# EAGLE design esp8266breakout (EAGLE 8.3.2)
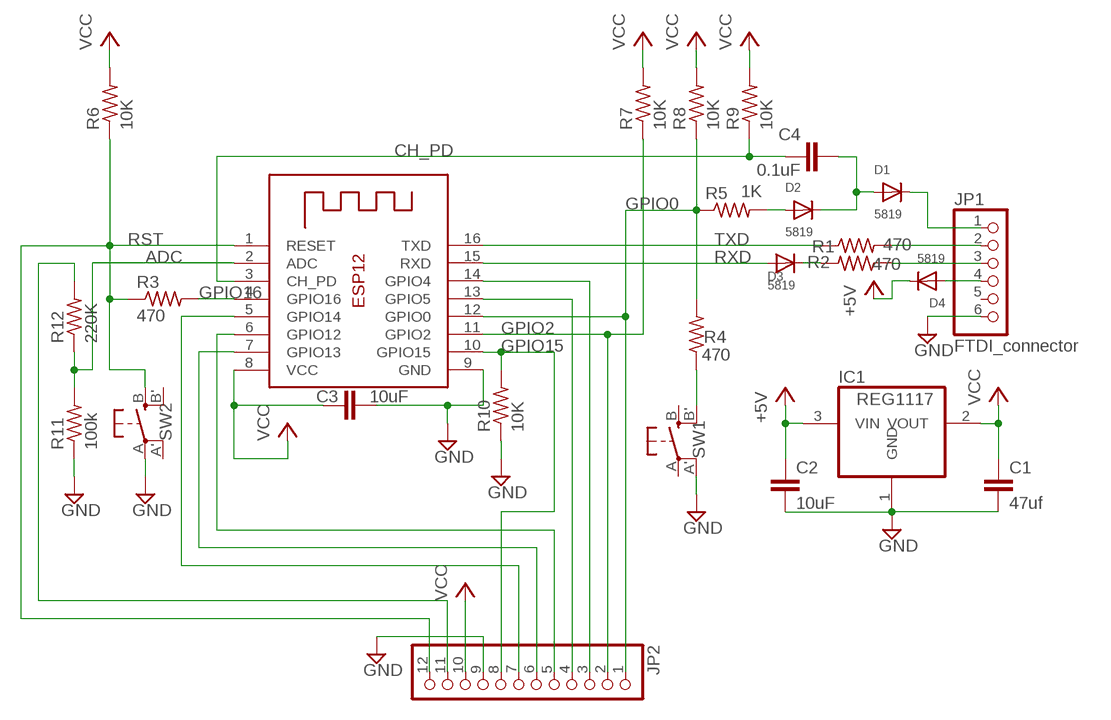
[diagram p0: schematic, sheet 1]

## Parts
C1  47uf  C-EUC1206K  [C1206K]
C2  10uF  C-EUC0805K  [C0805K]
C3  10uF  C-EUC0805K  [C0805K]
C4  0.1uF  C-EUC0805K  [C0805K]
D1  5819  DIODESOD-123  [SOD-123]
D2  5819  DIODESOD-123  [SOD-123]
D3  5819  DIODESOD-123  [SOD-123]
D4  5819  DIODESOD-123  [SOD-123]
IC1  REG1117  [SOT223]
JP1  FTDI_connector  PINHD-1X6LOCK  [1X06-BIGLOCK]
JP2  PINHD-1X12/90  [1X12/90]
R1  470  R-US_R0805  [R0805]
R2  470  R-US_R0805  [R0805]
R3  470  R-US_R0805  [R0805]
R4  470  R-US_R0805  [R0805]
R5  1K  R-US_R0805  [R0805]
R6  10K  R-US_R0805  [R0805]
R7  10K  R-US_R0805  [R0805]
R8  10K  R-US_R0805  [R0805]
R9  10K  R-US_R0805  [R0805]
R10  10K  R-US_R0805  [R0805]
R11  100k  R-US_R0805  [R0805]
R12  220K  R-US_R0805  [R0805]
SW1  6*6mm  SPST_TACT-EVQQ2  [EVQ-Q2]
SW2  6*6mm  SPST_TACT-EVQQ2  [EVQ-Q2]
X1  ESP_12S  ESP-12  [ESP-12]

## Nets
+5V: C2.1 D4.C IC1.3(VIN)
ADC: R11.2 R12.1 X1.2(ADC)
ADC_EXT: JP2.11 R12.2
CH_PD: C4.1 R9.1 X1.3(CH_PD)
DTR: D1.C JP1.1
GND: C1.2 C2.2 C3.2 IC1.1(GND) JP1.6 JP2.9 R10.1 R11.1 SW1.A'(P1) SW2.A(P) X1.9(GND)
GPIO0: JP2.1 R4.2 R5.1 R8.1 X1.12(GPIO0)
GPIO2: JP2.2 R7.1 X1.11(GPIO2)
GPIO4: JP2.3 X1.14(GPIO4)
GPIO5: JP2.4 X1.13(GPIO5)
GPIO12: JP2.5 X1.6(GPIO12)
GPIO13: JP2.6 X1.7(GPIO13)
GPIO14: JP2.7 X1.5(GPIO14)
GPIO15: JP2.8 R10.2 X1.10(GPIO15)
GPIO16: R3.2 X1.4(GPIO16)
N$1: R4.1 SW1.B'(S1)
N$2: C4.2 D1.A D2.C
N$3: D2.A R5.2
N$6: D3.C R2.2
RST: JP2.12 R3.1 R6.1 SW2.B(S) X1.1(RESET)
RXD: D3.A X1.15(RXD)
RXD_EXT: JP1.3 R2.1
TXD: R1.1 X1.16(TXD)
TXD_EXT: JP1.2 R1.2
VCC: C1.1 C3.1 IC1.2(VOUT) JP2.10 R6.2 R7.2 R8.2 R9.2 X1.8(VCC)
VIN: D4.A JP1.4
Unconnected: JP1.5 SW1.A(P) SW1.B(S) SW2.A'(P1) SW2.B'(S1)

## Library data of the parts
C1-C4 = resistor:C-EU: CAPACITOR, European symbol
D1-D4 = adafruit:DIODE: Diode SMADIODE - SMA Surface Mount Package 20V 1A Schottky Diode Digikey: 641-1014-6-ND DO-1N4148 - Through Hole Small Current Diode SOD-123 20V 1 A (.5mV Vf) Schottky Diode - Digikey: MBRX120TPMSCT-ND SOD-323 10V 570mA (.38mV Vf, 3ns) Schottky Diode - Digikey: ZLLS410CT-ND SOD-523 30V 30mA Schottky Diode (RB751S-40TE61) - Digikey: RB751S-40TE61CT-ND SOT23-R/W - SOT23 Package (R = Solder Paste/Reflow Ovens, W = Hand-Soldering) BAT54Film 40V 300mA - Digikey: 497-7162-1-ND
IC1 = burr-brown:REG1117: 800mA and 1A Low Dropout (LDO) Positive Regulator 1.8V, 2.5V, 2.85V, 3.3V, 5V, and Adj; MPN: REG1117; OC_FARNELL: 1097566; OC_NEWARK: 14P6981
JP1 = adafruit:PINHD-1X6: PIN HEADER
JP2 = pinhead:PINHD-1X12: PIN HEADER
R1-R12 = resistor:R-US_: RESISTOR, American symbol
SW1 SW2 = adafruit:SPST_TACT: SMT 6mm switch, EVQQ2 series http://www.ladyada.net/library/eagle
X1 = adafruit:ESP-12

## Board
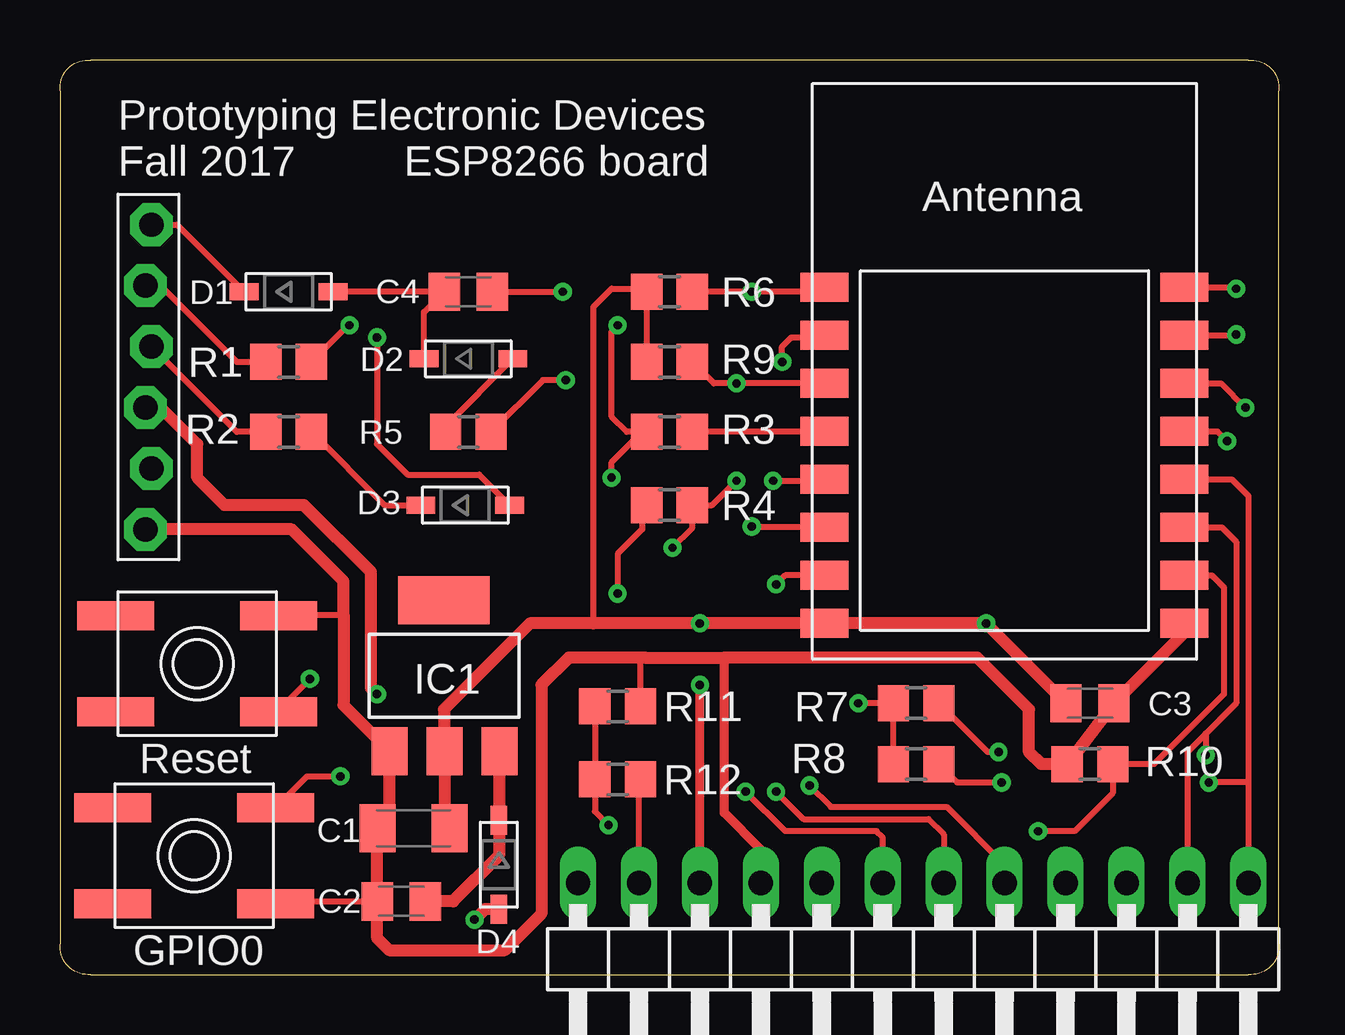
[diagram p1: board, top side]
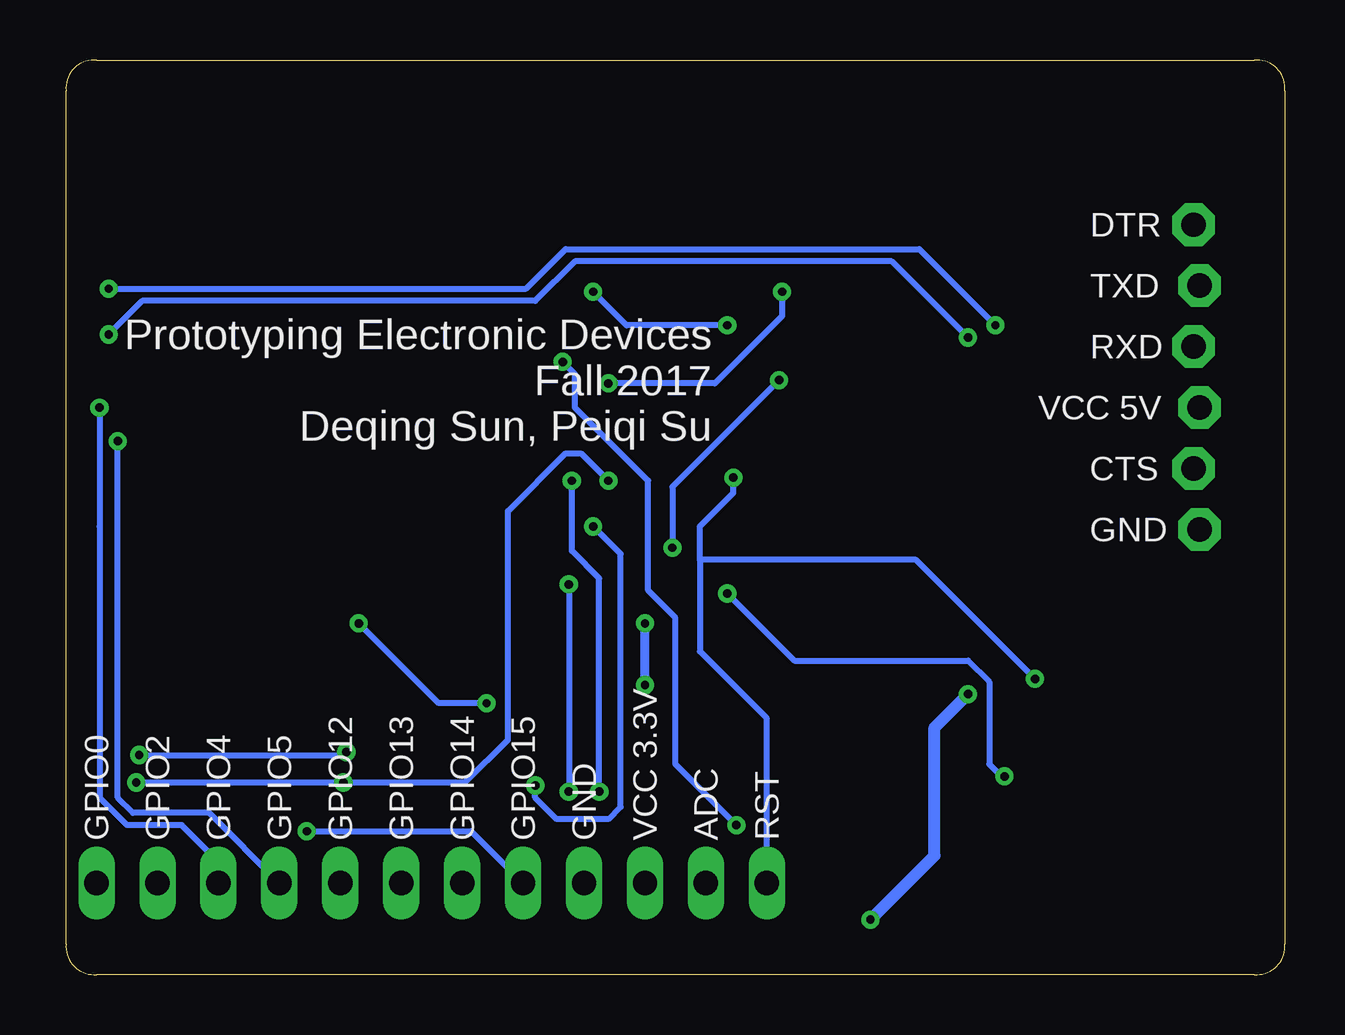
[diagram p2: board, bottom side, seen from below]

Size 50.81 x 38.11 mm. Coordinates in mm from the lower left corner, seen from the top.
Outline: 1.27,0 49.53,0 arc100 50.8,1.27 50.8,36.83 arc100 49.53,38.1 1.27,38.1 arc100 0,36.83 0,1.27 arc100 1.27,0
Copper layers (1*16): Top 0.035mm / dielectric 1.5mm / Bottom 0.035mm
Design rules "default *": minimum track width 10mil, minimum drill 0.3mm, track to track 10mil, track to pad 10mil, pad to pad 10mil, via to via 10mil, smd to smd 6mil, copper to edge 20mil, drill to drill 10mil, minimum pad ring 10mil, minimum via ring 8mil, stop-mask expansion 4mil, vias tented up to drill 14mil, thermal gap 10mil

### Footprints (pad centres in the part's own frame; a part is rotated, then mirrored left to right if it is on the bottom)
C1206K = smd 1.5 x 2: 1 -1.5,0; 2 1.5,0
C0805K = smd 1.3 x 1.6: 1 -1,0; 2 1,0
SOD-123 = smd 1.2 x 0.7: A 1.85,0; C -1.85,0
SOT223 = smd 1.499 x 2.007: 1 -2.261,-3.15; 2 0.025,-3.15; 3 2.311,-3.15 | smd 3.81 x 2.007: 4 0,3.15
1X06-BIGLOCK = drill 1.016 pad 1.778 octagon: 1 -6.35,0.127; 2 -3.81,-0.127; 3 -1.27,0.127; 4 1.27,-0.127; 5 3.81,0.127; 6 6.35,-0.127
1X12/90 = drill 1.016 long: 1 -13.97,-3.81; 2 -11.43,-3.81; 3 -8.89,-3.81; 4 -6.35,-3.81; 5 -3.81,-3.81; 6 -1.27,-3.81; 7 1.27,-3.81; 8 3.81,-3.81; 9 6.35,-3.81; 10 8.89,-3.81; 11 11.43,-3.81; 12 13.97,-3.81
R0805 = smd 1.3 x 1.5: 1 -0.95,0; 2 0.95,0
EVQ-Q2 = smd 3.2 x 1.2: A -3.4,-2; A' 3.4,-2; B -3.4,2; B' 3.4,2
ESP-12 = smd 2 x 1.2: 1 -7.5,4.5; 2 -7.5,2.5; 3 -7.5,0.5; 4 -7.5,-1.5; 5 -7.5,-3.5; 6 -7.5,-5.5; 7 -7.5,-7.5; 8 -7.5,-9.5; 9 7.5,-9.5; 10 7.5,-7.5; 11 7.5,-5.5; 12 7.5,-3.5; 13 7.5,-1.5; 14 7.5,0.5; 15 7.5,2.5; 16 7.5,4.5

### Placement (x,y rotation side)
C1  14.74,6.1 180 top
C2  14.23,3.05 180 top
C3  42.93,11.31 0 top
C4  17.02,28.45 180 top
D1  9.53,28.45 0 top
D2  17.02,25.66 0 top
D3  16.9,19.56 0 top
D4  18.29,4.58 270 top
IC1  16.01,12.45 0 top
JP1  3.69,24.9 270 top
JP2  35.56,0 180 top
R1  9.53,25.53 180 top
R2  9.53,22.61 0 top
R3  25.4,22.61 0 top
R4  25.4,19.56 0 top
R5  17.02,22.61 180 top
R6  25.4,28.45 180 top
R7  35.69,11.31 180 top
R8  35.69,8.77 180 top
R9  25.4,25.53 180 top
R10  42.93,8.77 0 top
R11  23.25,11.18 180 top
R12  23.25,8.13 0 top
SW1  5.59,4.96 0 top
SW2  5.72,12.96 180 top
X1  39.37,24.13 0 top

### Tracks (layer width: path | path; a pad name or v marks a point on that pad's centre or on a via)
+5V
  Top 0.508: IC1.3 18.29,9.28 D4.C 18.29,4.96 16.39,3.05 C2.1
ADC  (via drill 0.35)
  Top 0.254: R11.2 R12.1 22.3,6.8 v22.86,6.23 | v30.1,25.53 30.1,26.17 30.48,26.55 31.79,26.55 X1.2
  Bottom 0.254: v30.1,25.53 29.6,25.02 29.6,23.63 26.55,20.58 26.55,16.01 25.4,14.86 25.4,8.77 v22.86,6.23
ADC_EXT
  Top 0.254: JP2.11 24.13,8.07 R12.2
CH_PD  (via drill 0.35)
  Top 0.254: X1.3 v28.2,24.63 27.25,24.63 R9.1 | C4.1 v20.96,28.45
  Bottom 0.254: v20.96,28.45 20.96,27.44 23.76,24.63 v28.2,24.63
DTR
  Top 0.254: JP1.1 4.89,31.25 D1.C
GND
  Top 0.254: SW1.A' 9.09,3.05 C2.2 | SW2.A 9.15,14.99 11.82,14.99 | R11.1 24.2,13.02 24.39,13.21
  Top 0.381: JP2.9 29.21,5.21 27.69,6.74 27.69,13.21
  Top 0.508: X1.9 46.87,14.25 C3.2 R10.1 40.9,8.77 40.39,9.28 40.39,11.05 38.23,13.21 27.69,13.21 24.39,13.21 21.21,13.21 20.07,12.07 20.07,2.54 18.55,1.02 13.72,1.02 13.23,1.51 C2.2 13.23,6.09 C1.2 13.75,6.61 IC1.1 11.82,11.23 11.82,14.99 11.82,16.39 9.66,18.55 JP1.6
GPIO0  (via drill 0.35)
  Top 0.254: 49.53,8.01 49.53,19.94 48.84,20.63 X1.12 | 49.53,8.01 JP2.1 | 49.53,8.01 v47.88,8.01 | v39.25,8.01 37.4,8.01 R8.1 | v28.2,20.58 27.18,19.56 R4.2 26.35,18.61 v25.53,17.78 | R5.1 20.13,24.77 v21.09,24.77
  Bottom 0.254: v47.88,8.01 v39.25,8.01 34.17,8.01 32.39,9.78 32.39,19.31 29.98,21.72 29.34,21.72 v28.2,20.58 | v21.09,24.77 25.53,20.32 v25.53,17.78
GPIO2  (via drill 0.35)
  Top 0.254: X1.11 48.43,18.63 49.03,18.04 49.03,11.31 47.76,10.04 | 47.76,10.04 46.99,9.28 JP2.2 | 47.76,10.04 v47.76,9.15 | v39.12,9.28 38.67,9.28 R7.1
  Bottom 0.254: v47.76,9.15 39.25,9.15 v39.12,9.28
GPIO4  (via drill 0.35)
  Top 0.254: X1.14 48.4,24.63 v49.41,23.63
  Bottom 0.254: v49.41,23.63 49.41,18.68 | 49.41,18.68 49.41,18.67 | 49.41,18.68 49.41,7.37 48.26,6.23 45.98,6.23 44.45,4.7 JP2.3
GPIO5  (via drill 0.35)
  Top 0.254: X1.13 48.24,22.63 v48.65,22.23
  Bottom 0.254: JP2.4 44.84,6.74 48.01,6.74 48.65,7.37 v48.65,22.23
GPIO12  (via drill 0.35)
  Top 0.254: X1.6 28.87,18.63 v28.83,18.67 | JP2.5 39.37,4.58 36.96,6.99 32.14,6.99 v31.25,7.88
  Bottom 0.254: v31.25,7.88 31.25,7.37 30.36,6.48 28.2,6.48 27.69,6.99 27.69,17.53 v28.83,18.67
GPIO13  (via drill 0.35)
  Top 0.254: X1.7 30.22,16.63 v29.85,16.26 | JP2.6 36.83,5.85 36.2,6.48 30.99,6.48 v29.85,7.62
  Bottom 0.254: v29.85,16.26 v29.85,7.62
GPIO14  (via drill 0.35)
  Top 0.254: JP2.7 34.29,5.72 34.04,5.97 30.23,5.97 v28.58,7.62 | v29.72,20.58 31.82,20.58 X1.5
  Bottom 0.254: v28.58,7.62 28.58,16.51 29.72,17.66 v29.72,20.58
GPIO15  (via drill 0.35)
  Top 0.254: X1.10 48.02,16.63 48.52,16.13 48.52,11.69 45.6,8.77 R10.2 43.88,7.56 42.3,5.97 v40.77,5.97
  Bottom 0.254: v40.77,5.97 33.91,5.97 JP2.8
GPIO16
  Top 0.254: X1.4 31.87,22.61 R3.2
N$1  (via drill 0.35)
  Top 0.254: R4.1 24.26,19.37 24.26,18.55 23.25,17.53 v23.25,15.88 | SW1.B' 10.29,8.26 v11.69,8.26
  Bottom 0.254: v11.69,8.26 11.82,8.26 12.32,8.77 12.32,12.2 13.21,13.09 20.45,13.09 v23.25,15.88
N$2
  Top 0.254: D1.A C4.2 15.17,27.6 D2.C
N$3
  Top 0.254: D2.A 16.07,22.86 R5.2
N$6
  Top 0.254: R2.2 13.53,19.56 D3.C
RST  (via drill 0.35)
  Top 0.254: X1.1 31.87,28.45 v28.83,28.45 R6.1 | 24.26,22.61 R3.1 | 24.26,22.61 23.63,22.61 22.99,23.25 22.99,26.8 v23.25,27.06 | v22.99,20.71 22.99,21.34 24.26,22.61 | SW2.B 9.12,11.02 v10.42,12.32
  Bottom 0.254: v23.25,27.06 27.44,27.06 v28.83,28.45 | JP2.12 21.59,10.67 24.39,13.47 24.39,17.28 | v22.99,20.71 22.99,20.07 24.39,18.67 24.39,17.28 | v10.42,12.32 15.37,17.28 24.39,17.28
RXD  (via drill 0.35)
  Top 0.254: X1.15 48.99,26.63 v49.03,26.67 | D3.A 17.48,20.83 14.48,20.83 13.21,22.1 v13.21,26.55
  Bottom 0.254: v49.03,26.67 47.63,28.07 31.25,28.07 29.6,29.72 16.39,29.72 v13.21,26.55
RXD_EXT
  Top 0.254: R2.1 7.37,22.61 JP1.3
TXD  (via drill 0.35)
  Top 0.254: X1.16 48.97,28.63 v49.03,28.58 | v12.07,27.06 12,27.06 R1.1
  Bottom 0.254: v49.03,28.58 31.63,28.58 29.98,30.23 15.24,30.23 v12.07,27.06
TXD_EXT
  Top 0.254: JP1.2 4.2,28.71 7.37,25.53 R1.2
VCC  (via drill 0.35)
  Top 0.254: R8.2 R7.2 v33.28,11.31 | R9.2 R6.2 24.33,28.58 22.99,28.58 22.23,27.82 22.23,14.63
  Top 0.381: JP2.10 v26.67,12.07
  Top 0.508: C3.1 v38.6,14.63 X1.8 v26.67,14.63 22.23,14.63 19.59,14.63 16.01,11.05 16.01,9.33 IC1.2 16.03,6.31 C1.1
  Bottom 0.254: v33.28,11.31 35.28,11.31 v38.6,14.63
  Bottom 0.381: v26.67,12.07 v26.67,14.63
VIN  (via drill 0.35)
  Top 0.508: D4.A 17.71,2.73 v17.28,2.29 | v13.21,11.69 12.96,11.94 12.96,16.77 10.16,19.56 6.86,19.56 5.72,20.71 5.72,22.1 4.2,23.63 JP1.4
  Bottom 0.508: v17.28,2.29 14.61,4.96 14.61,10.29 v13.21,11.69

### Text on the board
tPlace: Prototyping Electronic Devices / Fall 2017 ESP8266 board | Reset | GPIO0
bPlace: DTR | TXD | RXD | Prototyping Electronic Devices / Fall 2017 / Deqing Sun, Peiqi Su | VCC 5V | CTS | GND | RST | ADC | VCC 3.3V | GND | GPIO15 | GPIO14 | GPIO13 | GPIO12 | GPIO5 | GPIO4 | GPIO2 | GPIO0